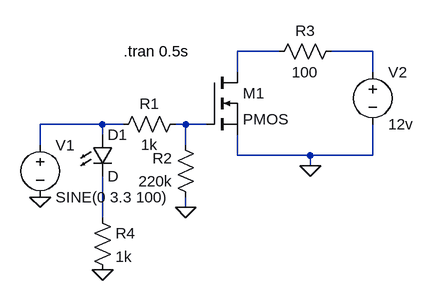
[diagram p0: schematic heater_block_model.asc]
heater_block_model.asc, the LTspice schematic file:
Version 4
SHEET 1 880 680
WIRE 240 112 176 112
WIRE 384 112 320 112
WIRE 176 144 176 112
WIRE 384 144 384 112
WIRE -32 224 -128 224
WIRE 0 224 -32 224
WIRE 96 224 80 224
WIRE 128 224 96 224
WIRE -32 240 -32 224
WIRE -128 256 -128 224
WIRE 96 256 96 224
WIRE 176 272 176 240
WIRE 288 272 176 272
WIRE 384 272 384 224
WIRE 384 272 288 272
WIRE 288 288 288 272
WIRE 96 352 96 336
WIRE -32 368 -32 304
FLAG 288 288 0
FLAG 96 352 0
FLAG -128 336 0
FLAG -32 448 0
SYMBOL nmos 128 144 R0
SYMATTR InstName M1
SYMATTR Value PMOS
SYMBOL voltage -128 240 R0
WINDOW 123 0 0 Left 0
WINDOW 39 0 0 Left 0
SYMATTR InstName V1
SYMATTR Value SINE(0 3.3 100)
SYMBOL voltage 384 128 R0
SYMATTR InstName V2
SYMATTR Value 12v
SYMBOL res 96 208 R90
WINDOW 0 0 56 VBottom 2
WINDOW 3 32 56 VTop 2
SYMATTR InstName R1
SYMATTR Value 1k
SYMBOL res 112 352 R180
WINDOW 0 36 76 Left 2
WINDOW 3 36 40 Left 2
SYMATTR InstName R2
SYMATTR Value 220k
SYMBOL res 336 96 R90
WINDOW 0 0 56 VBottom 2
WINDOW 3 32 56 VTop 2
SYMATTR InstName R3
SYMATTR Value 100
SYMBOL LED -48 240 R0
SYMATTR InstName D1
SYMBOL res -48 352 R0
SYMATTR InstName R4
SYMATTR Value 1k
TEXT 0 112 Left 2 !.tran 0.5s

The netlist it stands for:
* heater_block_model.asc
M1 N001 N004 0 0 PMOS
V1 N003 0 SINE(0 3.3 100)
V2 N002 0 12v
R1 N004 N003 1k
R2 0 N004 220k
R3 N002 N001 100
D1 N003 N005 D
R4 N005 0 1k
.model D D
.lib standard.dio
.model NMOS NMOS
.model PMOS PMOS
.lib standard.mos
.tran 0.5s
.backanno
.end